# Altium schematic sheet DCDC.SchDoc
size A4; SheetNumber: 4; SheetTotal: 6
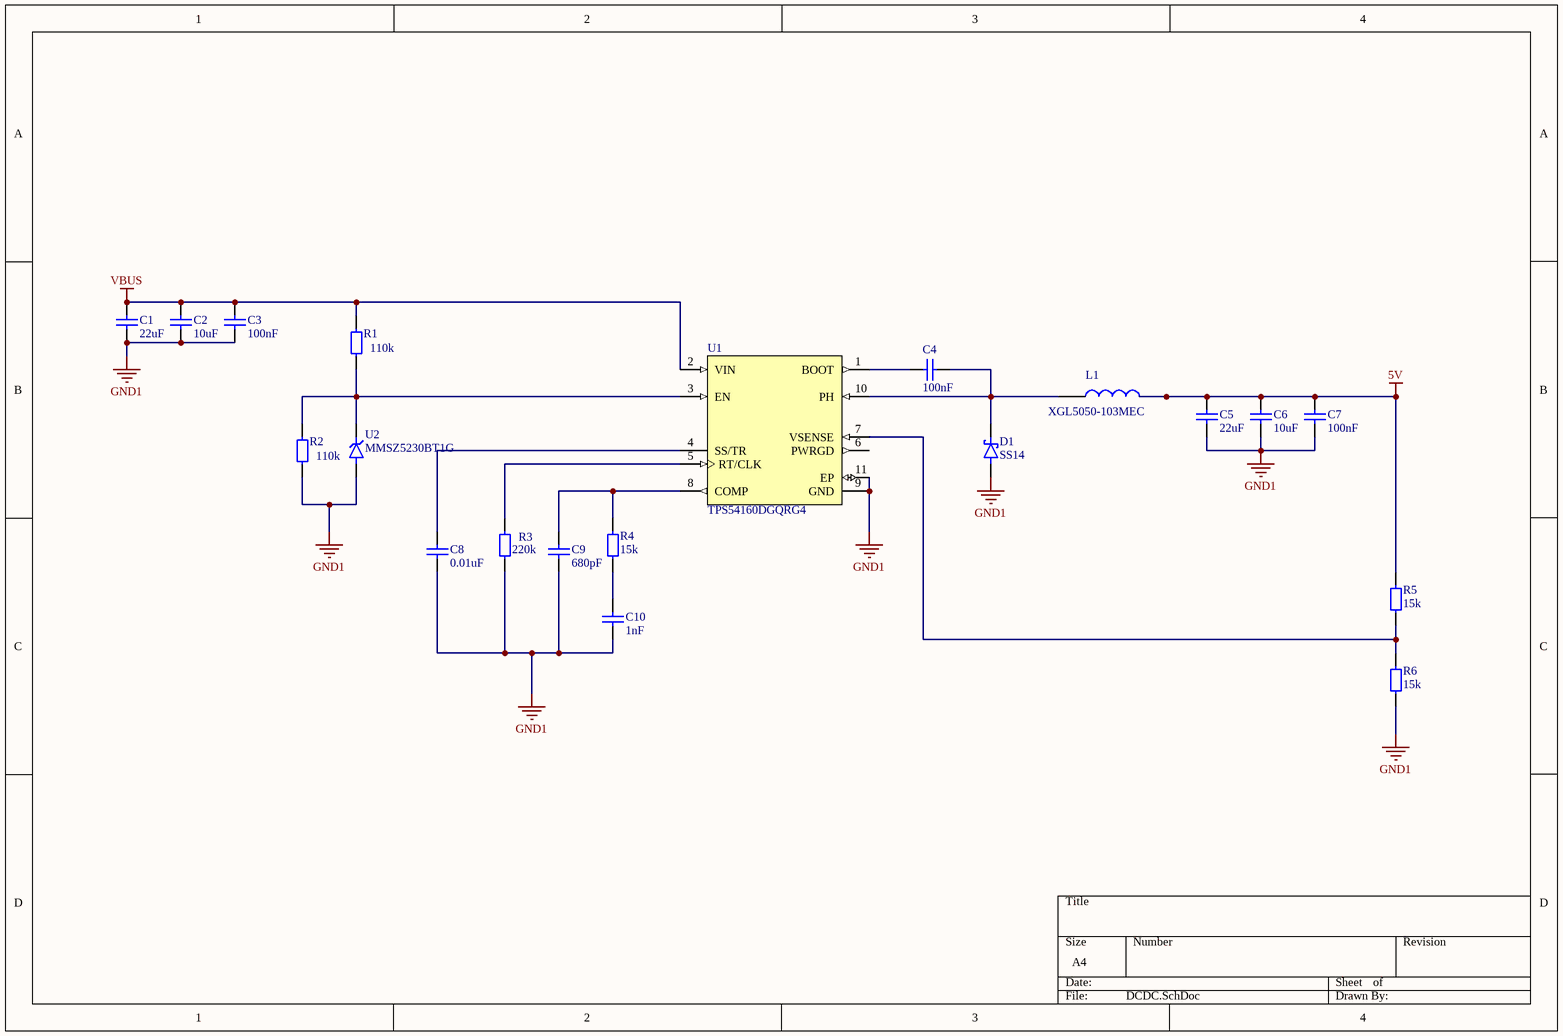
[diagram p0: DCDC.SchDoc]

## Parts
C1  22uF  [1210_CAP]
C2  10uF  [0805_CAP]
C3  100nF  [0603 Capacitor]
C4  100nF  [0603 Capacitor]
C5  22uF  [1210_CAP]
C6  10uF  [0805_CAP]
C7  100nF  [0603 Capacitor]
C8  0.01uF  [0603 Capacitor]
C9  680pF  [0603 Capacitor]
C10  1nF  [0603 Capacitor]
D1  SS14  [DIOM4330X250N]
L1  XGL5050-103MEC  [XGL5050]
R1  110k  [0603 Resistor]
R2  110k  [0603 Resistor]
R3  220k  [0603 Resistor]
R4  15k  [0603 Resistor]
R5  15k  [0603 Resistor]
R6  15k  [0603 Resistor]
U1  TPS54160DGQRG4  [IC_XTR111AIDGQR]
U2  MMSZ5230BT1G  [DIO_SZMMSZ5248CT1G]

## Nets
5V: C5.2 C6.2 C7.2 L1.2 R5.2(CW)
GND1: C1.1 C2.1 C3.1 C5.1 C6.1 C7.1 C8.1 C9.1 C10.1 D1.A R2.1(CCW) R3.1(CCW) R6.1(CCW) U1.9(GND) U1.11(EP) U2.2(A)
VBUS: C1.2 C2.2 C3.2 R1.2(CW) U1.2(VIN)
NetC4_1: C4.1 U1.1(BOOT)
NetC4_2: C4.2 D1.C(K) L1.1 U1.10(PH)
NetC8_2: C8.2 U1.4(SS/TR)
NetC9_2: C9.2 R4.2(CW) U1.8(COMP)
NetC10_2: C10.2 R4.1(CCW)
NetR1_1: R1.1(CCW) R2.2(CW) U1.3(EN) U2.1(K)
NetR3_2: R3.2(CW) U1.5(RT/CLK)
NetR5_1: R5.1(CCW) R6.2(CW) U1.7(VSENSE)

Not connected (* = marked no-connect by the designer): U1 6(PWRGD)

## Library data of the parts
C1 C5 = Capacitor 22uF 1210: 22uF 50V 1210
C2 C6 = Capacitor 10uF 0805: 10uF 50V 0805
C3 C4 C7-C10 = Capacitor 100nF 0603: 100nF 50V 0603
D1 = SS14: 1A, 40V, Schottky Rectifier; Value: *; Availability: Unavailable; Price: None; Package: None; MP: SS14
L1 = XGL5050-103MEC: 10uH Shielded Molded Inductor 2.5 A; Manufacturer_Name: COILCRAFT; Manufacturer_Part_Number: XGL5050-153MEC; Geometry.Height: 5.1mm; Mouser Part Number: *; Mouser Price/Stock: *; Arrow Part Number: *; Arrow Price/Stock: *; Datasheet Link: https://www.coilcraft.com/getmedia/348b2df6-54b3-4579-8737-e8367b6fa367/xgl5050.pdf
R1-R6 = Resistor 100k 0603: 100k 0603
U1 = TPS54160DGQRG4: 3.5V to 60V Input, 1.5A Step-Down Converter with Eco-Mode 10-HVSSOP -40 to 150; MF: Texas Instruments; SnapEDA_Link: https://www.snapeda.com/parts/TPS54160DGQRG4/Texas+Instruments/view-part/?ref=snap; Package: HVSSOP-10 Texas Instruments; Value: *; MP: TPS54160DGQRG4; Check_prices: https://www.snapeda.com/parts/TPS54160DGQRG4/Texas+Instruments/view-part/?ref=eda
U2 = MMSZ5230BT1G: Zener Diode 4.7V 500 mW ±2% Surface Mount SOD-123; MP: SZMMSZ5248CT1G; MF: ON Semiconductor; Package: SOD-123-2 ON Semiconductor; Value: *; SnapEDA_Link: https://www.snapeda.com/parts/SZMMSZ5248CT1G/Onsemi/view-part/?ref=snap; Check_prices: https://www.snapeda.com/parts/SZMMSZ5248CT1G/Onsemi/view-part/?ref=eda